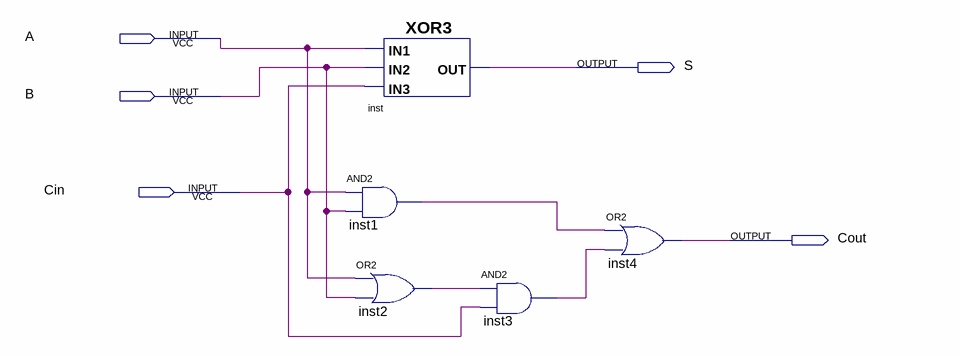
[diagram p0: schematic sheet]
// Quartus schematic full_adder.bdf as structural Verilog: 5 symbols, 5 pins
module full_adder (
  input  A,
  input  B,
  input  Cin,
  output S,
  output Cout
);

  wire inst1_out, inst2_out, inst3_out;

  XOR3 inst (.IN3(Cin), .IN1(A), .IN2(B), .OUT(S));
  and inst1 (inst1_out, A, B);
  or inst2 (inst2_out, A, B);
  and inst3 (inst3_out, inst2_out, Cin);
  or inst4 (Cout, inst1_out, inst3_out);
endmodule
